# Altium schematic sheet Sheet1.SchDoc
size A4
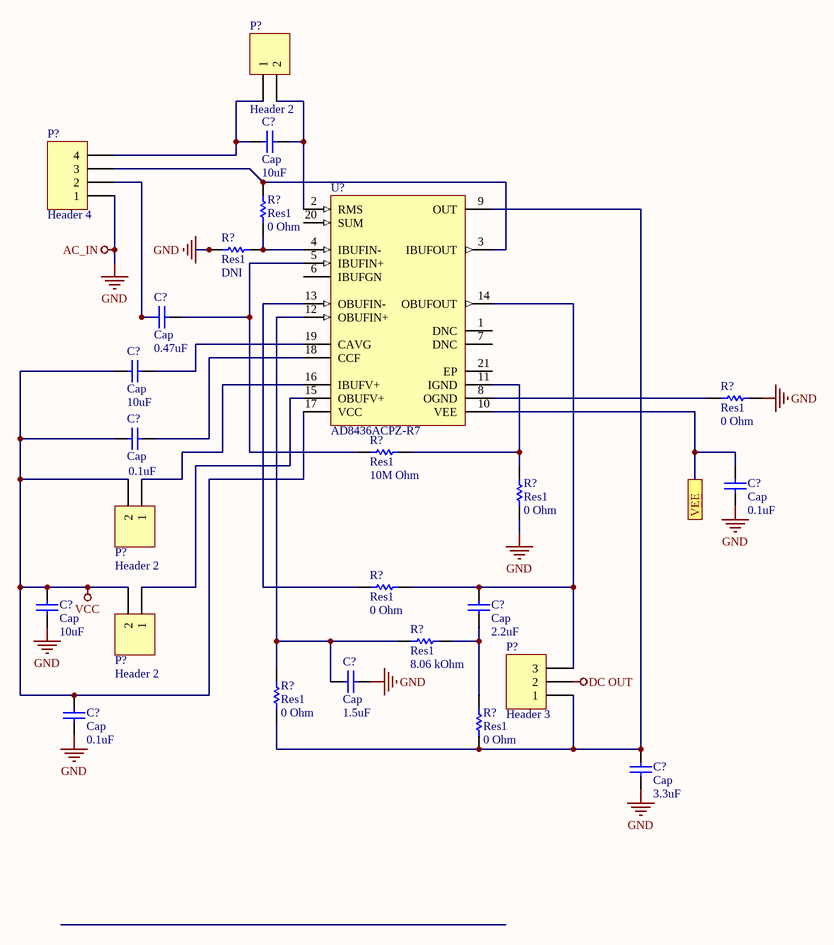
[diagram p0: Sheet1.SchDoc]

## Parts
(Parts that share a designator on the sheet are numbered #1, #2 ... from top to bottom, then left to right.)
C?#1  Cap  value 10uF  [RAD-0.3]
C?#2  Cap  value 0.47uF  [RAD-0.3]
C?#3  Cap  value 10uF  [RAD-0.3]
C?#4  Cap  value 0.1uF  [RAD-0.3]
C?#5  Cap  value 0.1uF  [RAD-0.3]
C?#6  Cap  value 10uF  [RAD-0.3]
C?#7  Cap  value 2.2uF  [RAD-0.3]
C?#8  Cap  value 1.5uF  [RAD-0.3]
C?#9  Cap  value 0.1uF  [RAD-0.3]
C?#10  Cap  value 3.3uF  [RAD-0.3]
P?#1  Header 2  [HDR1X2]
P?#2  Header 4  [HDR1X4]
P?#3  Header 2  [HDR1X2]
P?#4  Header 2  [HDR1X2]
P?#5  Header 3  [HDR1X3]
R?#1  Res1  value 0 Ohm  [AXIAL-0.3]
R?#2  Res1  value DNI  [AXIAL-0.3]
R?#3  Res1  value 0 Ohm  [AXIAL-0.3]
R?#4  Res1  value 10M Ohm  [AXIAL-0.3]
R?#5  Res1  value 0 Ohm  [AXIAL-0.3]
R?#6  Res1  value 0 Ohm  [AXIAL-0.3]
R?#7  Res1  value 8.06 kOhm  [AXIAL-0.3]
R?#8  Res1  value 0 Ohm  [AXIAL-0.3]
R?#9  Res1  value 0 Ohm  [AXIAL-0.3]
U?  AD8436ACPZ-R7  [ADI-CP-20-10_M]

## Ports
VEE

## Nets
AC_IN: C?#5.2 C?#6.2 C?#8.1 C?#9.2 C?#10.2 P?#2.1 R?#2.2 R?#3.1 R?#5.1  [also labelled GND]
DC OUT: P?#5.2
VCC: C?#3.2 C?#4.2 C?#6.1 C?#9.1 P?#3.2 P?#4.2 U?.17(VCC)
VEE: C?#5.1 U?.10(VEE) ; port VEE
NetC?#1_1: C?#1.1 P?#1.2 U?.2(RMS)
NetC?#1_2: C?#1.2 P?#1.1 P?#2.4
NetC?#2_1: C?#2.1 R?#4.2 U?.5(IBUFIN+)
NetC?#2_2: C?#2.2 P?#2.2
NetC?#3_1: C?#3.1 U?.19(CAVG)
NetC?#4_1: C?#4.1 U?.18(CCF)
NetC?#7_1: C?#7.1 P?#5.3 R?#6.1 U?.14(OBUFOUT)
NetC?#7_2: C?#7.2 R?#7.2 R?#9.1
NetC?#8_2: C?#8.2 R?#7.1 R?#8.1 U?.12(OBUFIN+)
NetC?#10_1: C?#10.1 P?#5.1 R?#8.2 R?#9.2 U?.9(OUT)
NetP?#2_3: P?#2.3 R?#1.1 U?.3(IBUFOUT)
NetP?#3_1: P?#3.1 U?.16(IBUFV+)
NetP?#4_1: P?#4.1 U?.15(OBUFV+)
NetR?#1_2: R?#1.2 R?#2.1 U?.4(IBUFIN-)
NetR?#3_2: R?#3.2 U?.8(OGND)
NetR?#4_1: R?#4.1 R?#5.2 U?.11(IGND)
NetR?#6_2: R?#6.2 U?.13(OBUFIN-)

Not connected (* = marked no-connect by the designer): U? 1(DNC) 6(IBUFGN) 7(DNC) 20(SUM) 21(EP)

## Library data of the parts
C?#1-C?#10 = Cap: Capacitor; Published: 8-Jun-2000; LatestRevisionDate: 17-Jul-2002; LatestRevisionNote: Re-released for DXP Platform.; PackageReference: RAD-0.3; Publisher: Altium Limited; PackageDescription: Radial Cap, Thru-Hole; 2 Leads; 0.3 in Pin Spacing
P?#1 P?#3 P?#4 = Header 2: Header, 2-Pin; LatestRevisionDate: 17-Jul-2002; LatestRevisionNote: Re-released for DXP Platform.; Publisher: Altium Limited
P?#2 = Header 4: Header, 4-Pin; LatestRevisionDate: 17-Jul-2002; LatestRevisionNote: Re-released for DXP Platform.; Publisher: Altium Limited
P?#5 = Header 3: Header, 3-Pin; LatestRevisionDate: 17-Jul-2002; LatestRevisionNote: Re-released for DXP Platform.; Publisher: Altium Limited
R?#1-R?#9 = Res1: Resistor; Published: 8-Jun-2000; LatestRevisionDate: 17-Jul-2002; LatestRevisionNote: Re-released for DXP Platform.; PackageReference: AXIAL-0.3; Publisher: Altium Limited; PackageDescription: Axial Device, Thru-Hole; 2 Leads; 0.3 in Pin Spacing
U? = CMP-0527-00003-3: Low Cost, Low Power, True RMS-to-DC Converter, 4.8 to 36 V Single Supply, -40 to 125 degC, 20-Pin QFN (CP-20-10); Manufacturer: Analog Devices; -3dB Bandwidth: 950 KHz; Max Vin (V-rms): 3 V rms; V Span (min): 4.8 V; Supply Current: 300 uA; V Span (max): 36 V; Error (%@ CF: 3)=0.5; PackageVersion: Rev. B; DatasheetVersion: Rev. B; PackageDescription: 20-Pin Frame Chip Scale Package, Body 4 x 4 mm, Pitch 0.5 mm; ComponentLink3URL: http://www.analog.com/static/imported-files/packages/PKG_PDF/LFCSP(CP)/CP_20_10.pdf; ComponentLink2Description: Datasheet; ComponentLink1Description: Manufacturer URL; Operating Temperature Range: -40 to 125 degC; ComponentLink1URL: http://www.analog.com/; ComponentLink3Description: Package Specification; RoHS: TRUE; PartNumber: AD8436ACPZ-R7; PackageReference: CP-20-10; ComponentLink2URL: http://www.analog.com/static/imported-files/data_sheets/AD8436.pdf; Mounting Technology: Surface Mount